# Altium schematic sheet STM32.SchDoc: STM32
size A4; CompanyName: HEIG-VD; Organization: Institut d'Automatisation Industrielle; SheetNumber: 3; SheetTotal: 6; SheetFormat: A4; CurrentTime: 6; CurrentDate: 5; DocumentFullPathAndName: 8; DocumentName: 9; ModifiedDate: 13; ProjectName: <projet>
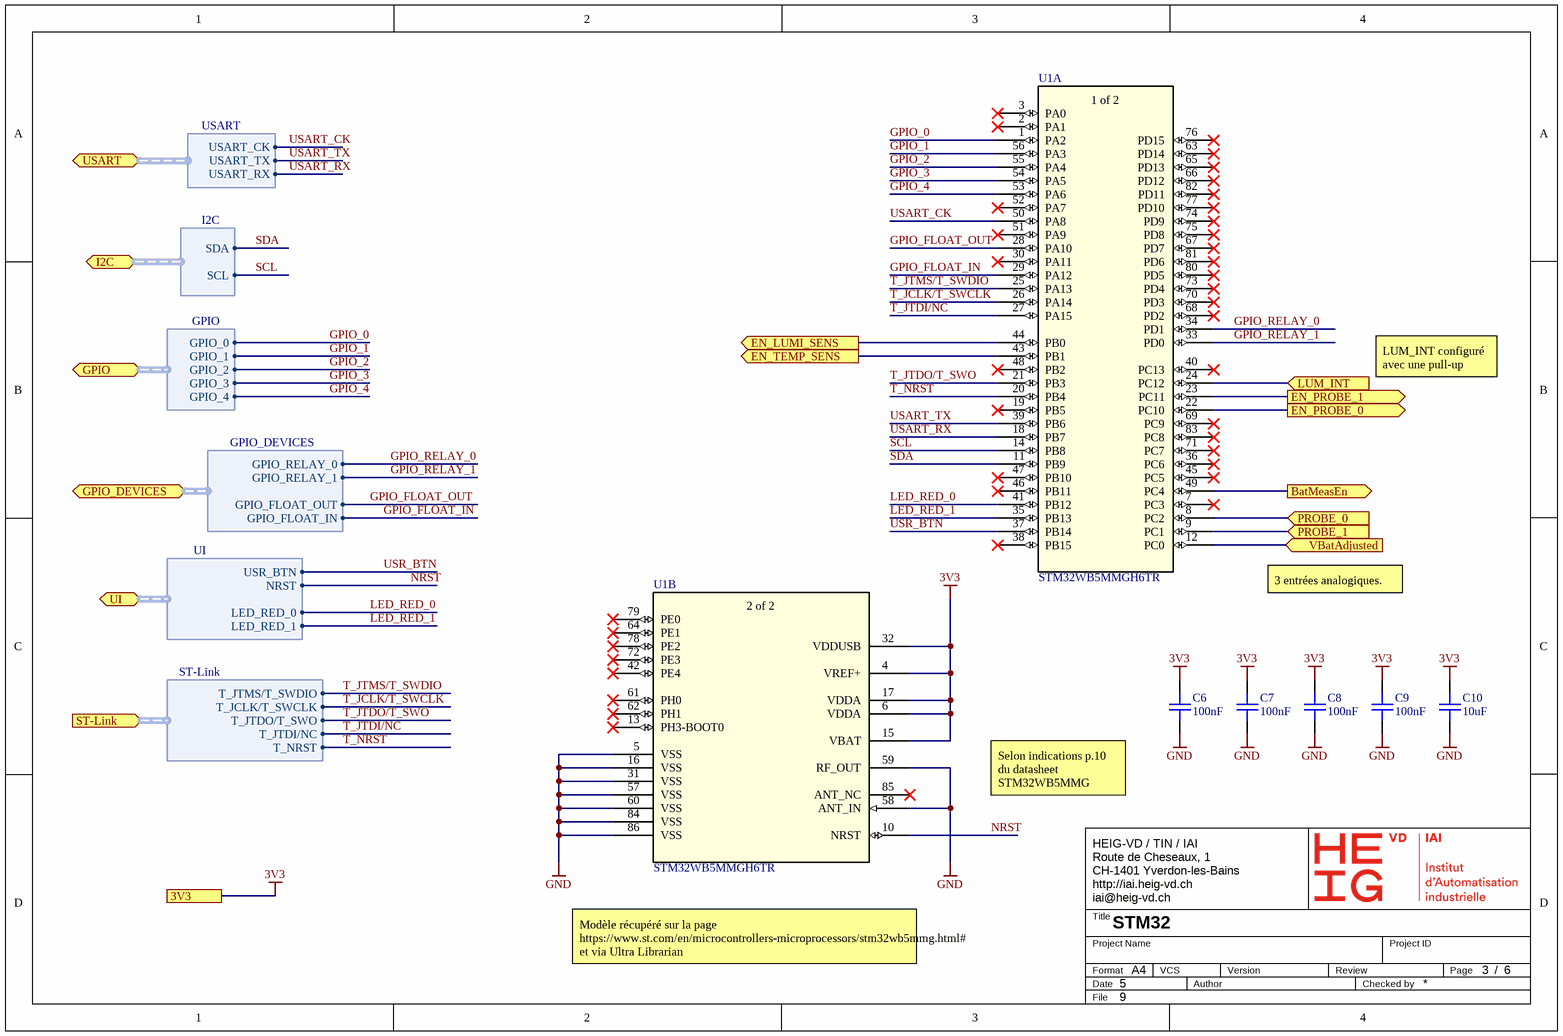
[diagram p0: STM32.SchDoc]

## Parts
C6  100nF  [CAPC1005X05N]
C7  100nF  [CAPC1005X05N]
C8  100nF  [CAPC1005X05N]
C9  100nF  [CAPC1005X05N]
C10  10uF  [CAPC3216X18N]
U1  STM32WB5MMGH6TR  [SIP-LGA86_STM]  (parts A,B of 2)

## Ports
3V3, BatMeasEn (out), EN_LUMI_SENS (out), EN_PROBE_0 (out), EN_PROBE_1 (out), EN_TEMP_SENS (out), GPIO (bidir, harness GPIO), GPIO_DEVICES (bidir, harness GPIO_DEVICES), I2C (bidir, harness I2C), LUM_INT (in), PROBE_0 (in), PROBE_1 (in), ST-Link (in, harness ST-Link), UI (bidir, harness UI), USART (bidir, harness USART), VBatAdjusted (in)

## Harnesses
I2C: SDA, SCL
ST-Link: T_JTMS/T_SWDIO, T_JCLK/T_SWCLK, T_JTDO/T_SWO, T_NRST, T_JTDI/NC
USART: USART_CK, USART_RX, USART_TX
GPIO: GPIO_0, GPIO_1, GPIO_2, GPIO_3, GPIO_4
GPIO_DEVICES: GPIO_RELAY_0, GPIO_RELAY_1, GPIO_FLOAT_OUT, GPIO_FLOAT_IN
UI: USR_BTN, NRST, LED_RED_0, LED_RED_1

## Nets
3V3: C6.1 C7.1 C8.1 C9.1 C10.2 U1.4(VREF+) U1.6(VDDA) U1.15(VBAT) U1.17(VDDA) U1.32(VDDUSB) ; port 3V3
GND: C6.2 C7.2 C8.2 C9.2 C10.1 U1.5(VSS) U1.16(VSS) U1.31(VSS) U1.57(VSS) U1.58(ANT_IN) U1.59(RF_OUT) U1.60(VSS) U1.84(VSS) U1.86(VSS)
BatMeasEn: U1.49(PC4) ; port BatMeasEn
EN_LUMI_SENS: U1.44(PB0) ; port EN_LUMI_SENS
EN_PROBE_0: U1.22(PC10) ; port EN_PROBE_0
EN_PROBE_1: U1.23(PC11) ; port EN_PROBE_1
EN_TEMP_SENS: U1.43(PB1) ; port EN_TEMP_SENS
GPIO_0: U1.1(PA2) ; port GPIO.GPIO_0
GPIO_1: U1.56(PA3) ; port GPIO.GPIO_1
GPIO_2: U1.55(PA4) ; port GPIO.GPIO_2
GPIO_3: U1.54(PA5) ; port GPIO.GPIO_3
GPIO_4: U1.53(PA6) ; port GPIO.GPIO_4
GPIO_FLOAT_IN: U1.29(PA12) ; port GPIO_DEVICES.GPIO_FLOAT_IN
GPIO_FLOAT_OUT: U1.28(PA10) ; port GPIO_DEVICES.GPIO_FLOAT_OUT
GPIO_RELAY_0: U1.34(PD1) ; port GPIO_DEVICES.GPIO_RELAY_0
GPIO_RELAY_1: U1.33(PD0) ; port GPIO_DEVICES.GPIO_RELAY_1
LED_RED_0: U1.41(PB12) ; port UI.LED_RED_0
LED_RED_1: U1.35(PB13) ; port UI.LED_RED_1
LUM_INT: U1.24(PC12) ; port LUM_INT
NRST: U1.10(NRST) ; port UI.NRST
PROBE_0: U1.8(PC2) ; port PROBE_0
PROBE_1: U1.9(PC1) ; port PROBE_1
SCL: U1.14(PB8) ; port I2C.SCL
SDA: U1.11(PB9) ; port I2C.SDA
T_JCLK/T_SWCLK: U1.26(PA14) ; port ST-Link.T_JCLK/T_SWCLK
T_JTDI/NC: U1.27(PA15) ; port ST-Link.T_JTDI/NC
T_JTDO/T_SWO: U1.21(PB3) ; port ST-Link.T_JTDO/T_SWO
T_JTMS/T_SWDIO: U1.25(PA13) ; port ST-Link.T_JTMS/T_SWDIO
T_NRST: U1.20(PB4) ; port ST-Link.T_NRST
USART_CK: U1.50(PA8) ; port USART.USART_CK
USART_RX: U1.18(PB7) ; port USART.USART_RX
USART_TX: U1.39(PB6) ; port USART.USART_TX
USR_BTN: U1.37(PB14) ; port UI.USR_BTN
VBatAdjusted: U1.12(PC0) ; port VBatAdjusted

Not connected (* = marked no-connect by the designer): U1 2(PA1)* 3(PA0)* 7(PC3)* 13(PH3-BOOT0)* 19(PB5)* 30(PA11)* 36(PC6)* 38(PB15)* 40(PC13)* 42(PE4)* 45(PC5)* 46(PB11)* 47(PB10)* 48(PB2)* 51(PA9)* 52(PA7)* 61(PH0)* 62(PH1)* 63(PD14)* 64(PE1)* 65(PD13)* 66(PD12)* 67(PD7)* 68(PD2)* 69(PC9)* 70(PD3)* 71(PC7)* 72(PE3)* 73(PD4)* 74(PD9)* 75(PD8)* 76(PD15)* 77(PD10)* 78(PE2)* 79(PE0)* 80(PD5)* 81(PD6)* 82(PD11)* 83(PC8)* 85(ANT_NC)*

## Notes on the sheet
- LUM_INT configuré avec une pull-up
- 3 entrées analogiques.
- Selon indications p.10 du datasheet STM32WB5MMG
- Modèle récupéré sur la page https://www.st.com/en/microcontrollers-microprocessors/stm32wb5mmg.html# et via Ultra Librarian
- Title
- HEIG-VD / TIN / IAI
  Route de Cheseaux, 1
  CH-1401 Yverdon-les-Bains
  http://iai.heig-vd.ch
  iai@heig-vd.ch
- Format
- Date
- Project Name
- VCS
- Author
- Version
- Review
- Checked by
- Project ID
- Page
- /
- File
- (in symbol STM32WB5MMGH6TR, part A) 1 of 2
- (in symbol STM32WB5MMGH6TR, part B) 2 of 2

## Library data of the parts
C6-C9 = CMP-0003371-1: 100nF 10% 50V Ceramic Capacitor X8L 0402 (1005 Metric); Value: 100nF; Max Operating Temperature: 150°C; Case/Package: 0402 (1005 Metric); Temperature Coefficient: X8L; Mounting Technology: Surface Mount; Voltage Rating: 50V; Min Operating Temperature: -55°C; RoHS Compliant: Yes; Tolerance: 10%
C10 = CMP-0001778-4: 10 µF ±10% 50V Ceramic Capacitor X7R 1206 (3216 Metric); Value: 10µF; Max Operating Temperature: 125°C; Mounting Technology: Surface Mount; RoHS Compliant: Yes; Min Operating Temperature: -55°C; Temperature Coefficient: X7R; Tolerance: 10%; Voltage Rating: 50V; Case/Package: 1206 (3216 Metric)
U1 = STM32WB5MMGH6TR: No Description Available; Mfr_Name: STMicroelectronics; RefDes: RefDes; Type: Type